# Altium project (4V-12V)-24V Boost Converter.PrjPcb
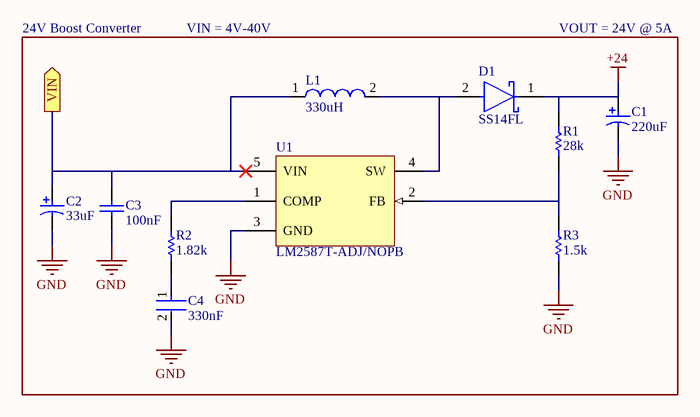
[diagram p0: (4V-12V)-24V Boost Converter.SchDoc]
1 sheet, 10 parts. Net scope: flat (ports and power ports of the same name join across sheets).

## Sheet (4V-12V)-24V Boost Converter.SchDoc
size A4

### Parts
C1  220uF  [PNSC-EEE-FK1E221P_N]
C2  33uF  [NIC-CAPA2-6.3X5.8_V]
C3  100nF  [CAPC2013X88X50NL20T25]
C4  330nF  [FP-CC0805-0_85-MFG]
D1  SS14FL  [FP-425AD-MFG]
L1  330uH  [WE-TI-LM-SHLD]
R1  28k  [RESC2013X70X40ML20T20]
R2  1.82k  [RESC2013X60X35ML10T20]
R3  1.5k  [RESC2013X70X40ML20T20]
U1  LM2587T-ADJ/NOPB  [NDH0005A]

### Ports
VIN (out)

### Nets
+24: C1.1 D1.1(C) R1.2
GND: C1.2 C2.2 C3.1 C4.2 R3.1 U1.3(GND)
NetC2_1: C2.1 C3.2 L1.1 U1.5(VIN) ; port VIN
NetC4_1: C4.1 R2.1
NetD1_2: D1.2(A) L1.2 U1.4(SW)
NetR1_1: R1.1 R3.2 U1.2(FB)
NetR2_2: R2.2 U1.1(COMP)

### Notes on the sheet
- 24V Boost Converter
- VIN = 4V-40V
- VOUT = 24V @ 5A

### Library data of the parts
C1 = CMP-1665-00017-3: Aluminum Electrolytic Capacitor, 220 uF, +/- 20%, 25 V, -55 to 105 degC, 2-Pin CAPAE, RoHS, Tape and Reel; Manufacturer: Panasonic; Voltage Rating: 25 V; ComponentLink2URL: http://industrial.panasonic.com/cdbs/www-data/pdf/RDE0000/ABA0000C1181.pdf; Height: 10.2 mm; Max Operating Temperature: 105 degC; PackageReference: EEE-FK1E221P; ComponentLink1Description: Manufacturer URL; ComponentLink1URL: http://www.panasonic.com/; Mount: Surface Mount; REACH SVHC: No SVHC; Min Operating Temperature: -55 degC; ComponentLink2Description: Datasheet; DatasheetVersion: 03/2016; Length: 10.2 mm; RoHSCompliant: true; Packaging: Tape and Reel; Package Quantity: 500; Lead Pitch: 3.1 mm; Pins: 2; PackageDescription: 2-Pin Electrolytic Aluminum Capacitor, Body 8.3 x 8.3 mm; Mounting Technology: Surface Mount; Supplier 1: Digi-Key; Supplier Part Number 1: PCE3800CT-ND; Supplier 2: LCSC; Supplier Part Number 2: C128511
C2 = CMP-0687-00044-1: Aluminum Electrolytic Capacitor, UD Series, Low Impedance, 33 uF, 35 V, + / - 20%, -55 to 105 degC, Chip Type, 6.3 x 5.8 mm D x L, Pb-Free, Reel; PartNumber: UUD1V330MCL1GS; Manufacturer: Nichicon; Rated Ripple Current (at 100kHz): 230 mA; Endurance Time: 2000 h; Packing: Dia382mm Reel; Tolerance Rated Capacitance: -20 to 20%; Impedance: 0.44 Ohm; Rated Voltage: 35 V; RoHS: TRUE; PackageReference: CAPAE-D6.3H5.8; ComponentLink3Description: Package Specification; Rated Capacitance: 33 uF; Diameter: 6.3 mm; PackageDescription: 2-Pin Surface Mount Device, Diameter 6.3 mm, Height 5.8 mm, Pitch 5.4 mm; ComponentLink1URL: http://www.nichicon.co.jp/; Length: 5.8 mm; ComponentLink1Description: Manufacturer URL; ComponentLink2URL: http://products.nichicon.co.jp/en/pdf/XJA043/e-ud.pdf; ComponentLink3URL: http://products.nichicon.co.jp/en/pdf/XJA043/e-ud.pdf; ComponentLink2Description: Datasheet; Mounting Technology: Surface Mount; DatasheetVersion: 08/2012; Supplier 1: Digi-Key; Supplier Part Number 1: 493-2286-1-ND; Supplier 2: LCSC; Supplier Part Number 2: C445251
C3 = CMP-2007-00279-1: Part Number: C0805C104K5RACTU; Manufacturer: Kemet; Supplier 1: Digi-Key; Supplier Part Number 1: 399-1170-6-ND
C4 = CMP-03422-000902-1: CAP CER 0.33UF 25V X7R 0805; Manufacturer: Yageo; Manufacturer Part Number: CC0805KKX7R8BB334; Material: Ceramic; Tolerance: 0.1; Category: Cap; Mouser Description: Multilayer Ceramic Capacitors MLCC - SMD/SMT 330nF 25V X7R 10%; Device Class L3: Ceramic Capacitors; ComponentLink2URL: http://www.yageo.com/documents/recent/UPY-GPHC_Y5V_6.3V-to-50V_8.pdf; Device Class L1: Passive Components; Temperature Characteristic: X7R; Temperature Range Low: -30°C; Octopart: https://octopart.com/cc0805kkx7r8bb334-yageo-24732840; Temperature: -30°C to +85°C; Capacitance: 330 nF; ComponentLink2Description: Datasheet; Ipc Land Pattern Name: CAPC200125X85; Device Class L2: Capacitors; Automotive: No; Temperature Range High: +85°C; Package: CC0805-0.85; Height: 0.95mm; RoHS: TRUE; Lead Free: Yes; Digikey Description: CAP CER 0.33UF 25V X7R 0805; Footprint Url: http://www.yageo.com/exep/pages/download/literatures/UPY-C_GEN_24.pdf; Voltage Rating: 25 V; Value: 330 nF; Supplier 1: Digi-Key; Supplier Part Number 1: 311-3385-1-ND
D1 = CMP-07162-000013-1: DIODE SCHOTTKY 40V 1A SOD123F; Manufacturer: ON Semiconductor; Max Junction Temp: +125°C; Value: 60pF; Max Surge Forward Current: 40A; Peak Reverse Current: 30uA; Device Class L3: Schottky Diodes; Reverse Voltage: 40V; Automotive: No; Temperature: -55°C to +125°C; Mouser Description: SS14FL Series 40 V 1 A Surface Mount Schottky Barrier Rectifier - SOD-123F; Octopart: https://octopart.com/ss14fl-on+semiconductor-84331601; Height: 1.08mm; Temperature Range Low: -55°C; Category: Diode; Lead Free: Yes; Device Class L1: Discrete Semiconductors; Digikey Description: DIODE SCHOTTKY 40V 1A SOD123F; RoHS: TRUE; ComponentLink2Description: Datasheet; Manufacturer Part Number: SS14FL; Forward Current: 1A; Capacitance: 60pF; Package: 425AD; Device Class L2: Diodes; Temperature Range High: +125°C; Max Repetitive Reverse Voltage: 40V; ComponentLink2URL: https://www.onsemi.com/pub/Collateral/SS14FL-D.PDF; Supplier 1: Digi-Key; Supplier Part Number 1: SS14FLCT-ND; Supplier 2: LCSC; Supplier Part Number 2: C118876
L1 = CMP-1406-00022-1: Shielded Radial Leaded Wire Wound Inductor WE-TIS, L=330 µH; PartNumber: 744731331; Manufacturer: Wuerth Elektronik; Inductance: 330 µH; ComponentLink1URL: http://www.we-online.com; ComponentLink2URL: http://www.we-online.de/katalog/media/pdf/744731331.pdf; ComponentLink1Description: Manufacturer URL; ComponentLink2Description: Datasheet; PackageDescription: THT Inductor, 2-Leads, Body 7.8 x 7.8 mm; PackageReference: WE-TI-LM-SHLD; Supplier 1: Digi-Key; Supplier Part Number 1: 732-3738-ND
R1 = CMP-2001-00099-1: Part Number: ERJ-6ENF2802V; Manufacturer: Panasonic; Supplier 1: Digi-Key; Supplier Part Number 1: P28.0KCCT-ND
R2 = CMP-2001-00945-1: Part Number: RC0805FR-07182KL; Manufacturer: Yageo; Supplier 1: Digi-Key; Supplier Part Number 1: 311-182KCRCT-ND
R3 = CMP-2001-04438-1: Manufacturer: Panasonic; Part Number: ERJ-6ENF1501V; Supplier 1: Digi-Key; Supplier Part Number 1: P1.50KCCT-ND
U1 = CMP-0069-01971-3: 5A Flyback Regulator, 5-pin TO-220, Pb-Free; Manufacturer: Texas Instruments; PackageTopMarking: NSUZXYTTE#*LM2587T*-ADJ P+; PowerWise: N; CompType: Switcher; PartNumber: LM2587T-ADJ/NOPB; ComponentLink1Description: Datasheet URL; PackageDescription: TO-220, Molded, Stagger Bend, 5 Lead; PinCount: 5; PackageReference: NDH0005A; RoHS: Y; ComponentLink1URL: http://www.ti.com/general/docs/lit/getliterature.tsp?genericPartNumber=LM2587&fileType=pdf; Supplier 1: Digi-Key; Supplier Part Number 1: LM2587T-ADJ/NOPB-ND